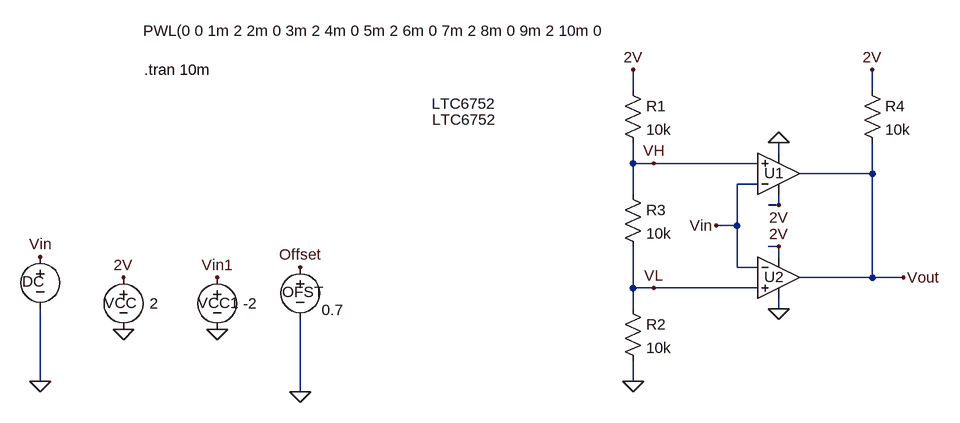
[diagram p0: schematic Window Comparator.asc]
Window Comparator.asc, the LTspice schematic file:
Version 4
SHEET 1 1288 680
WIRE 624 -208 624 -240
WIRE 992 -208 992 -240
WIRE 848 -112 848 -128
WIRE 624 -96 624 -128
WIRE 656 -96 624 -96
WIRE 816 -96 656 -96
WIRE 992 -80 992 -128
WIRE 992 -80 880 -80
WIRE 816 -64 784 -64
WIRE 624 -48 624 -96
WIRE 848 -32 848 -48
WIRE 848 -32 832 -32
WIRE 784 0 784 -64
WIRE 784 0 752 0
WIRE 848 32 832 32
WIRE 848 48 848 32
WIRE 784 64 784 0
WIRE 816 64 784 64
WIRE 992 80 992 -80
WIRE 992 80 880 80
WIRE 1040 80 992 80
WIRE 624 96 624 32
WIRE 656 96 624 96
WIRE 816 96 656 96
WIRE 624 128 624 96
WIRE 848 128 848 112
WIRE -288 240 -288 128
WIRE 624 240 624 208
WIRE 112 256 112 144
FLAG -160 80 2V
FLAG -160 160 0
FLAG -288 240 0
FLAG -288 48 Vin
FLAG -16 160 0
FLAG 848 32 2V
FLAG 112 256 0
FLAG 112 64 Offset
FLAG 1040 80 Vout
FLAG -16 80 Vin1
FLAG 848 -32 2V
FLAG 848 -128 0
FLAG 848 128 0
FLAG 752 0 Vin
FLAG 624 -240 2V
FLAG 624 240 0
FLAG 992 -240 2V
FLAG 656 -96 VH
FLAG 656 96 VL
SYMBOL voltage -288 32 R0
WINDOW 123 0 0 Left 0
WINDOW 39 0 0 Left 0
WINDOW 0 -28 54 Left 2
WINDOW 3 158 -332 Left 2
SYMATTR InstName DC
SYMATTR Value PWL(0 0 1m 2 2m 0 3m 2 4m 0 5m 2 6m 0 7m 2 8m 0 9m 2 10m 0
SYMBOL voltage -160 64 R0
WINDOW 0 -30 55 Left 2
WINDOW 3 40 56 Left 2
WINDOW 123 0 0 Left 0
WINDOW 39 0 0 Left 0
SYMATTR InstName VCC
SYMATTR Value 2
SYMBOL voltage -16 64 R0
WINDOW 0 -30 55 Left 2
WINDOW 3 40 56 Left 2
WINDOW 123 0 0 Left 0
WINDOW 39 0 0 Left 0
SYMATTR InstName VCC1
SYMATTR Value -2
SYMBOL voltage 112 48 R0
WINDOW 123 0 0 Left 0
WINDOW 39 0 0 Left 0
WINDOW 0 -28 54 Left 2
WINDOW 3 33 82 Left 2
SYMATTR InstName OFST
SYMATTR Value 0.7
SYMBOL res 608 -224 R0
SYMATTR InstName R1
SYMATTR Value 10k
SYMBOL res 608 112 R0
SYMATTR InstName R2
SYMATTR Value 10k
SYMBOL res 608 -64 R0
SYMATTR InstName R3
SYMATTR Value 10k
SYMBOL res 976 -224 R0
SYMATTR InstName R4
SYMATTR Value 10k
SYMBOL Comparators\\LTC6752 848 16 R0
WINDOW 0 -22 63 Left 2
WINDOW 3 -533 -179 Left 2
SYMATTR InstName U2
SYMBOL Comparators\\LTC6752 848 -16 M180
WINDOW 0 -22 65 Left 2
WINDOW 3 -534 172 Left 2
SYMATTR InstName U1
TEXT -128 -240 Left 2 !.tran 10m

The netlist it stands for:
* Window Comparator.asc
V§DC Vin 0 PWL(0 0 1m 2 2m 0 3m 2 4m 0 5m 2 6m 0 7m 2 8m 0 9m 2 10m 0
VCC 2V 0 2
VCC1 Vin1 0 -2
V§OFST Offset 0 0.7
R1 2V VH 10k
R2 VL 0 10k
R3 VH VL 10k
R4 2V Vout 10k
XU2 VL Vin 2V 0 Vout LTC6752  ; pins In+ In- V+ V- OUT
XU1 VH Vin 2V 0 Vout LTC6752  ; pins In+ In- V+ V- OUT
.tran 10m
.lib LTC7.lib
.backanno
.end